# EAGLE design Hammercopy (EAGLE 6.3)
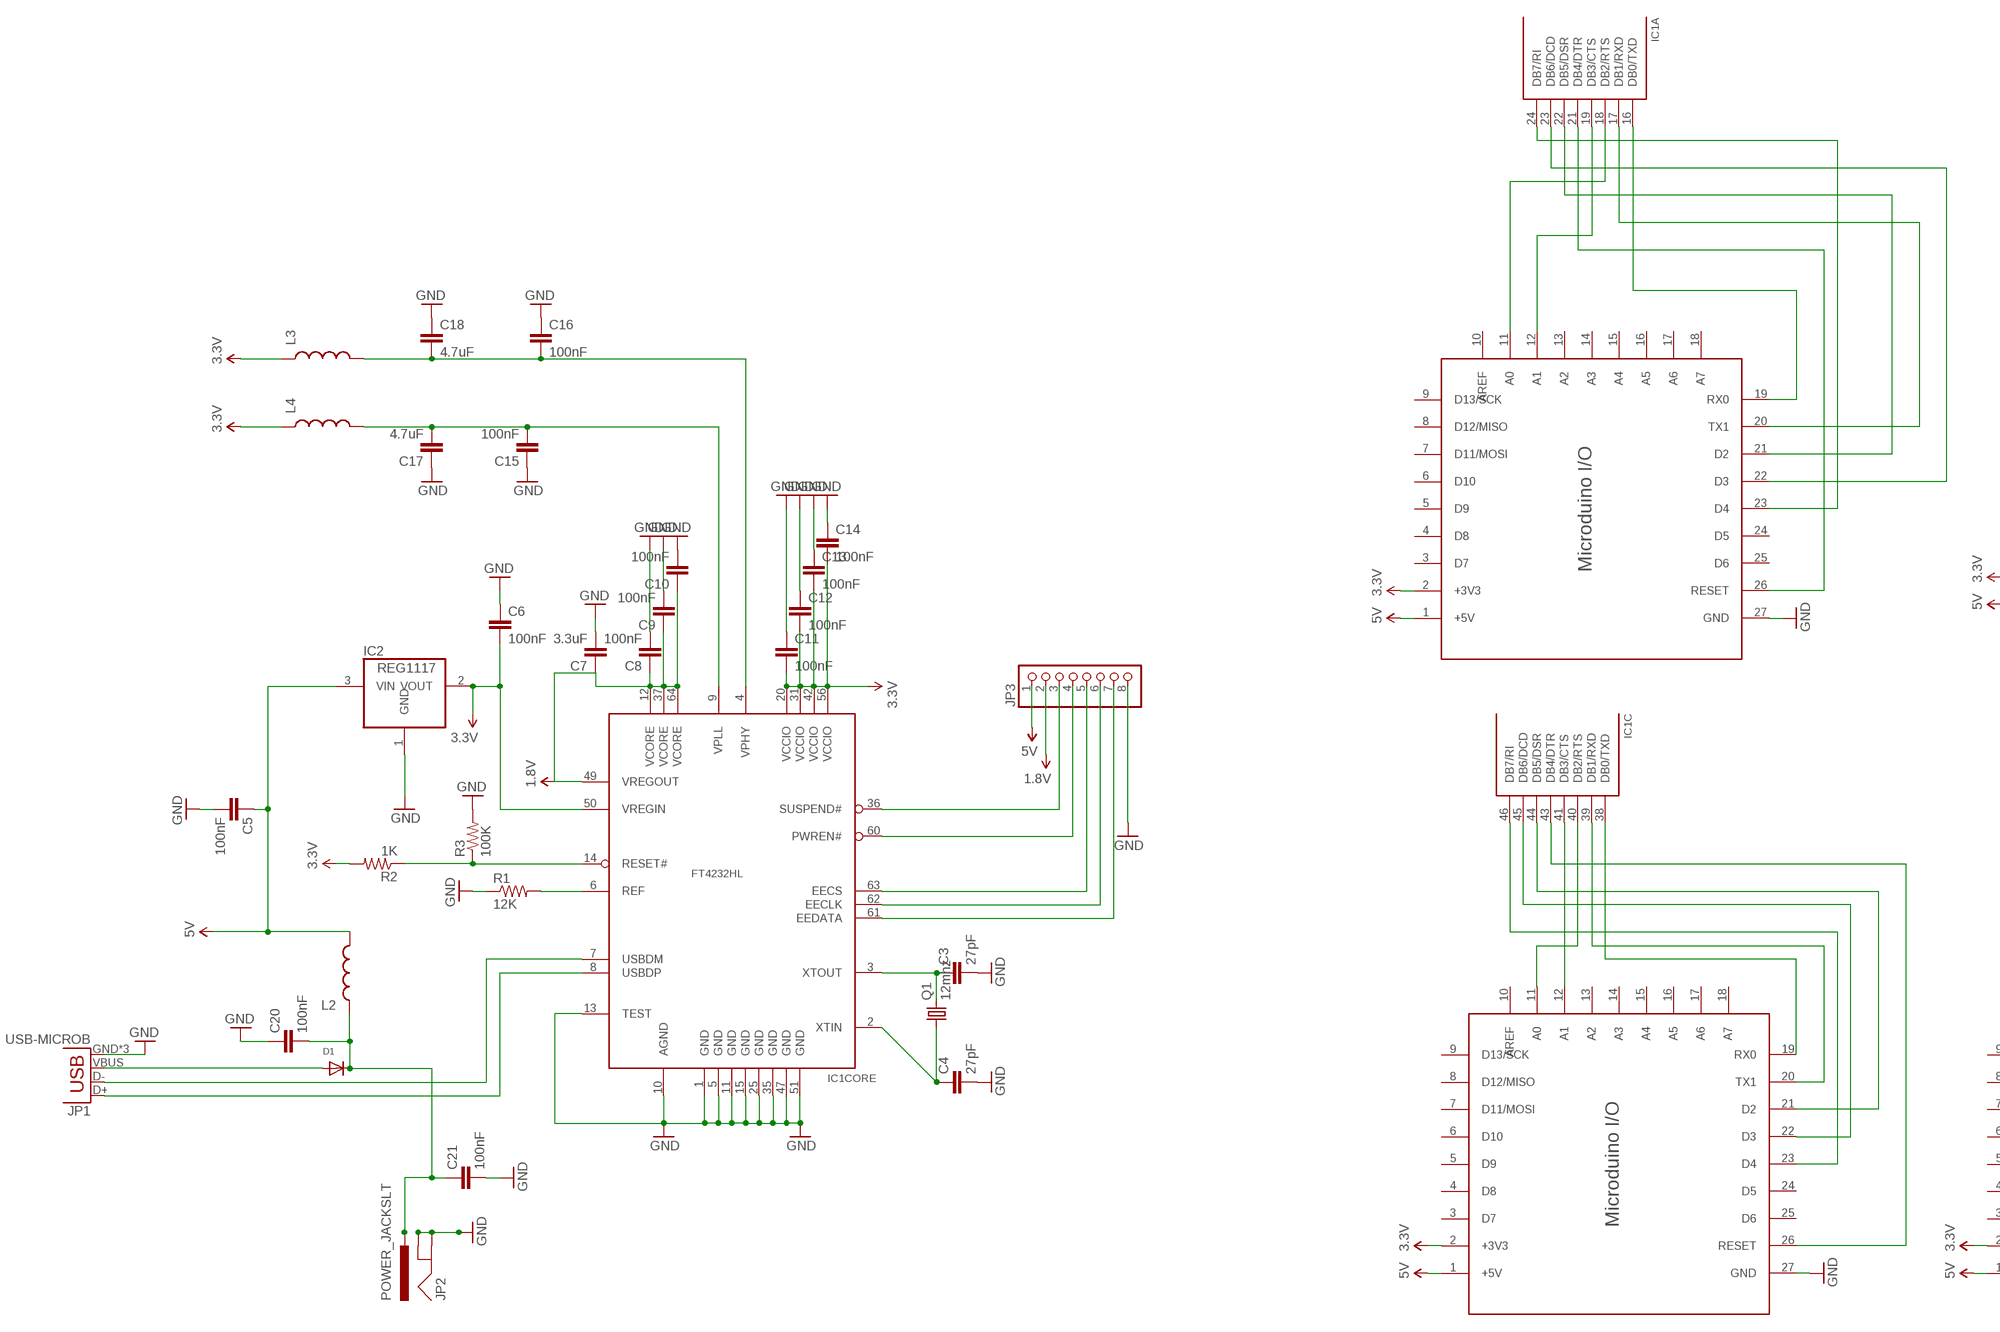
[diagram p0: schematic, sheet 1, part 1 of 2]
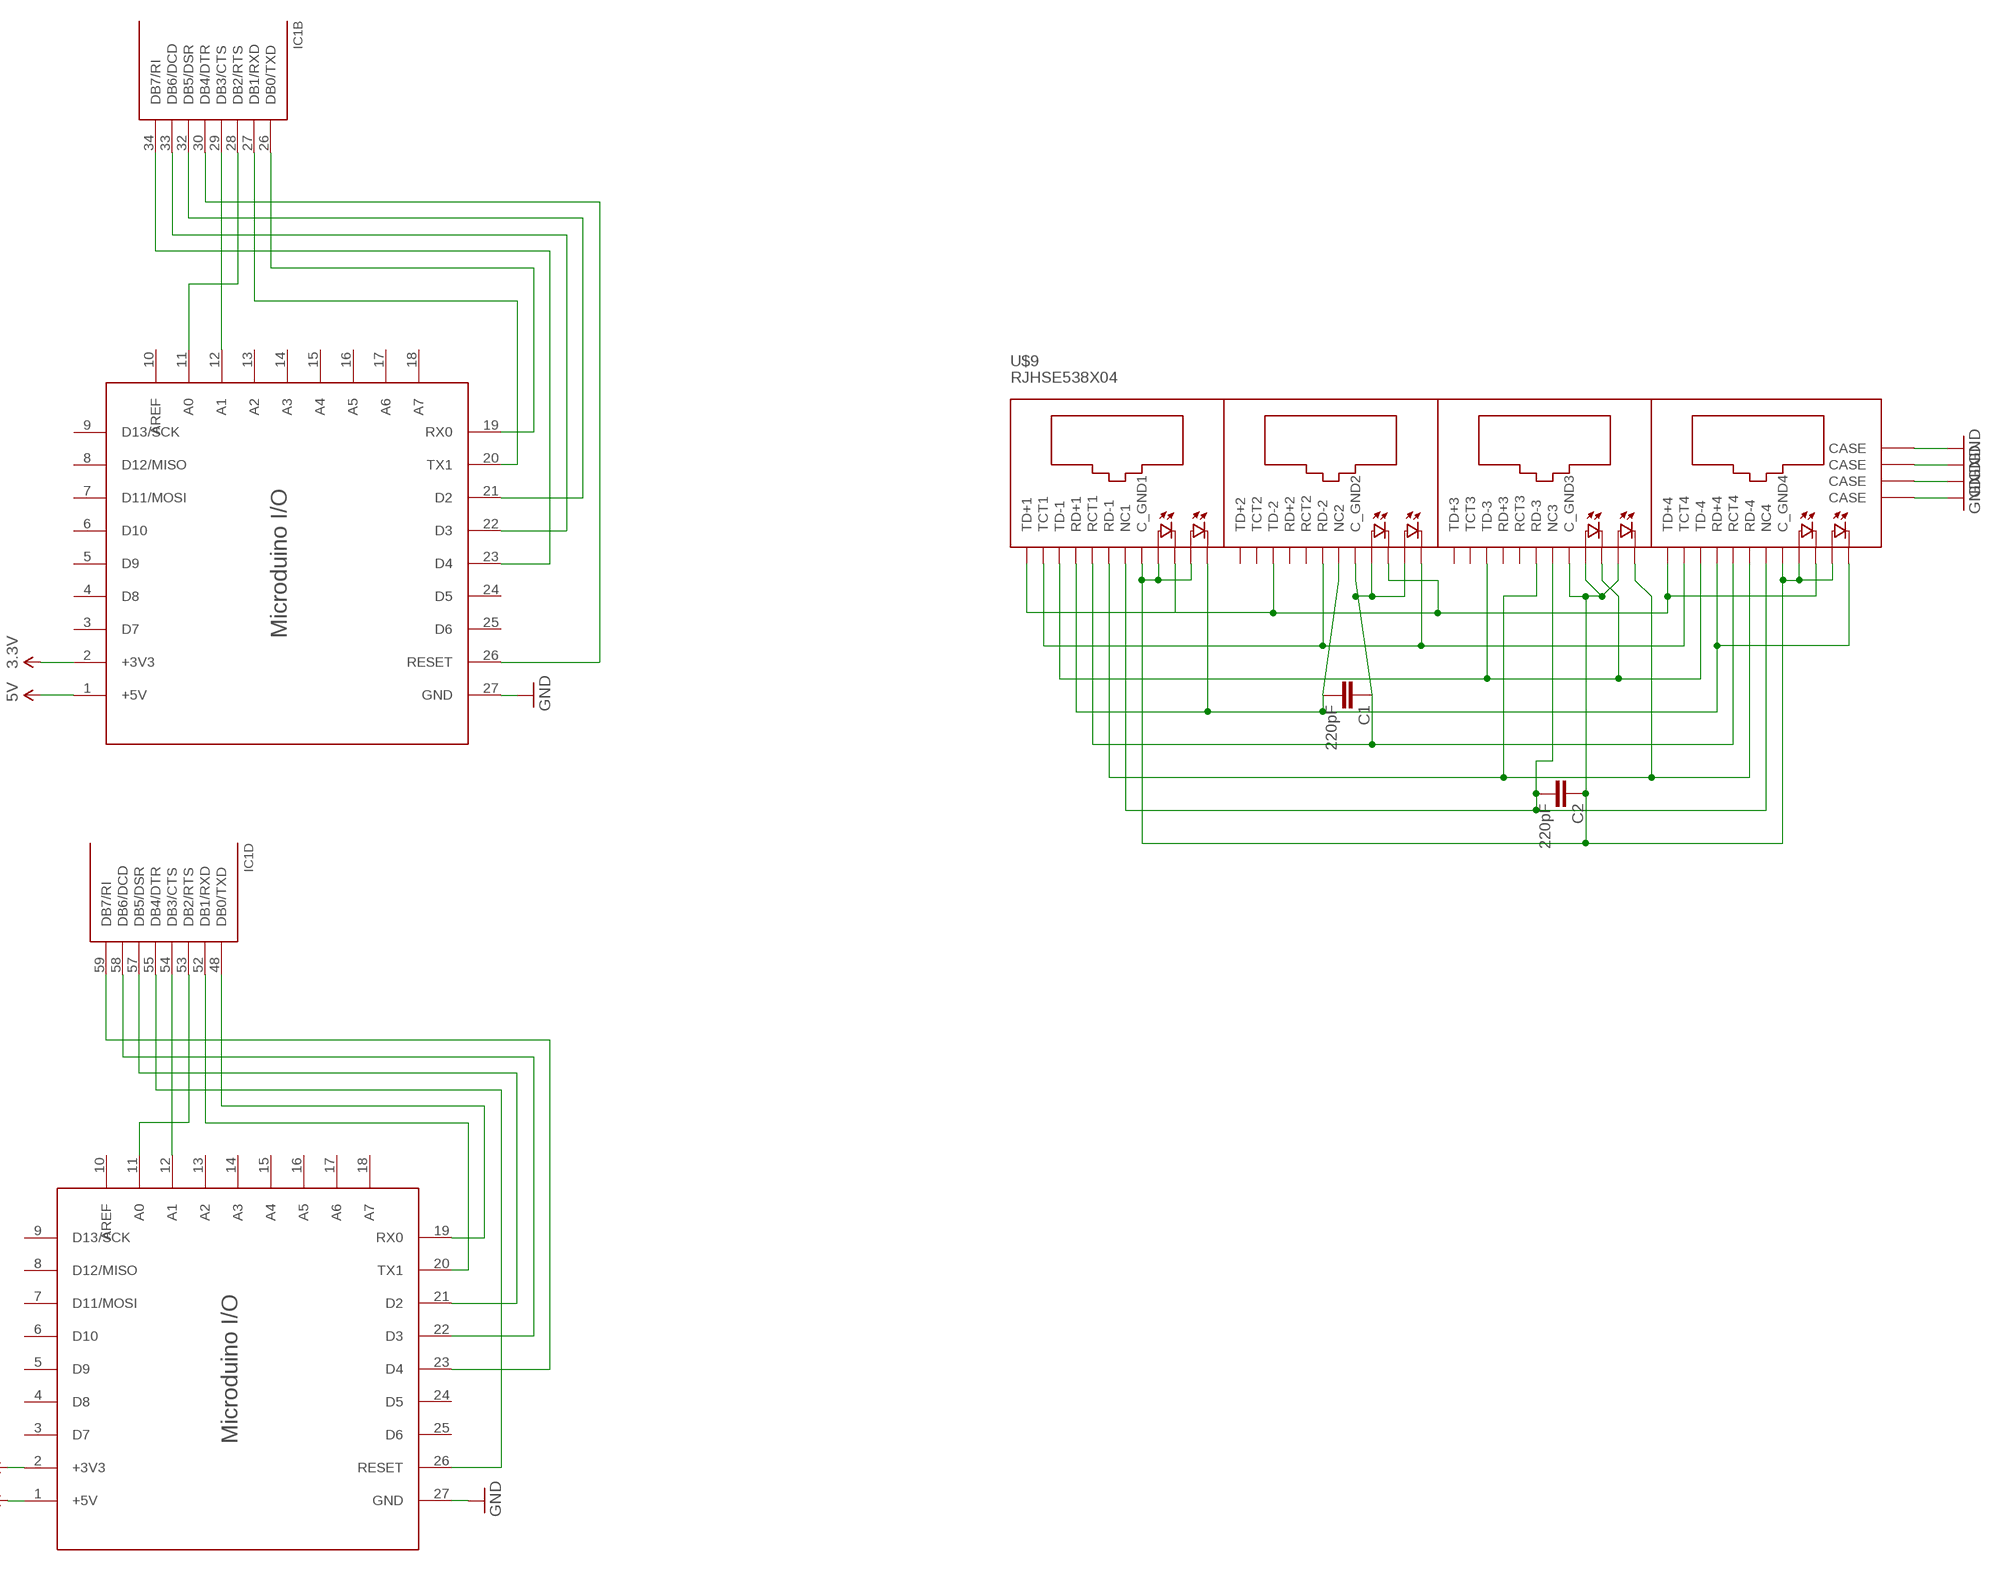
[diagram p1: schematic, sheet 1, part 2 of 2]

## Parts
C1  220pF  CAP0402-CAP  [0402-CAP]
C2  220pF  CAP0402-CAP  [0402-CAP]
C3  27pF  CAP0402-CAP  [0402-CAP]
C4  27pF  CAP0402-CAP  [0402-CAP]
C5  100nF  CAP0402-CAP  [0402-CAP]
C6  100nF  0.1UF-16V(+-10%)(0402)  [0402-CAP]
C7  3.3uF  0.1UF-16V(+-10%)(0402)  [0402-CAP]
C8  100nF  0.1UF-16V(+-10%)(0402)  [0402-CAP]
C9  100nF  0.1UF-16V(+-10%)(0402)  [0402-CAP]
C10  100nF  0.1UF-16V(+-10%)(0402)  [0402-CAP]
C11  100nF  0.1UF-16V(+-10%)(0402)  [0402-CAP]
C12  100nF  0.1UF-16V(+-10%)(0402)  [0402-CAP]
C13  100nF  0.1UF-16V(+-10%)(0402)  [0402-CAP]
C14  100nF  0.1UF-16V(+-10%)(0402)  [0402-CAP]
C15  100nF  0.1UF-16V(+-10%)(0402)  [0402-CAP]
C16  100nF  0.1UF-16V(+-10%)(0402)  [0402-CAP]
C17  4.7uF  0.1UF-16V(+-10%)(0402)  [0402-CAP]
C18  4.7uF  0.1UF-16V(+-10%)(0402)  [0402-CAP]
C20  100nF  0.1UF-16V(+-10%)(0402)  [0402-CAP]
C21  100nF  0.1UF-16V(+-10%)(0402)  [0402-CAP]
D1  DIODESMA  [SMADIODE]
IC1  FT4232HL  [LQFP64]
IC2  REG1117  [SOT223]
JP1  USB-MICROB  [USB-MICROB]
JP2  POWER_JACKSLT  [POWER_JACK_SLOT]
JP3  PINHD-1X8BIG  [1X08-BIG]
L2  INDUCTOR1206H*  [INDUCTOR-1206]
L3  INDUCTOR1206H*  [INDUCTOR-1206]
L4  INDUCTOR1206H*  [INDUCTOR-1206]
Q1  12mhz  CRYSTALHC49UP  [HC49UP]
R1  12K  RESISTOR0402-RES  [0402-RES]
R2  1K  RESISTOR0402-RES  [0402-RES]
R3  100K  RESISTOR0402-RES  [0402-RES]
U$5  MICRODUINO_PING-MICRDUINO/1009-TEST  [MICRODUINO_PIN-MICRODUINO-1009-TEST]
U$6  MICRODUINO_PING-MICRDUINO/1009-TEST  [MICRODUINO_PIN-MICRODUINO-1009-TEST]
U$7  MICRODUINO_PING-MICRDUINO/1009-TEST  [MICRODUINO_PIN-MICRODUINO-1009-TEST]
U$8  MICRODUINO_PING-MICRDUINO/1009-TEST  [MICRODUINO_PIN-MICRODUINO-1009-TEST]
U$9  RJHSE538X04  [RJHSE538X04]

## Nets
1.8V: C7.1 C8.1 C9.1 C10.1 IC1.12(CORE:VCORE) IC1.37(CORE:VCORE) IC1.49(CORE:VREGOUT) IC1.64(CORE:VCORE) JP3.2
3.3V: C6.2 C11.2 C12.2 C13.2 C14.2 IC1.20(CORE:VCCIO) IC1.31(CORE:VCCIO) IC1.42(CORE:VCCIO) IC1.56(CORE:VCCIO) IC2.2(VOUT) L3.P$1 L4.P$1 R2.2 U$5.2(+3V3) U$6.2(+3V3) U$7.2(+3V3) U$8.2(+3V3)
5V: C5.1 IC2.3(VIN) JP3.1 L2.P$2 U$5.1(+5V) U$6.1(+5V) U$7.1(+5V) U$8.1(+5V)
ASDF: C2.1 U$9.1-8(C_GND1) U$9.1-10(A2) U$9.1-12(A1) U$9.3-8(C_GND3) U$9.3-10(A6) U$9.3-12(A5)
GND: C3.2 C4.2 C5.2 C6.1 C7.2 C8.2 C9.2 C10.2 C11.1 C12.1 C13.1 C14.1 C15.1 C16.1 C17.1 C18.1 C20.1 C21.2 IC1.1(CORE:GND) IC1.5(CORE:GND) IC1.10(CORE:AGND) IC1.11(CORE:GND) IC1.13(CORE:TEST) IC1.15(CORE:GND) IC1.25(CORE:GND) IC1.35(CORE:GND) JP1.GND JP1.MT1(GND) JP1.MT2(GND) JP2.GND@1(GNDBREAK) JP2.GND@2(GND) JP3.8 R1.1 R3.2 U$5.27(GND) U$6.27(GND) U$7.27(GND) U$8.27(GND) U$9.CASE@1(CASE) U$9.CASE@2(CASE) U$9.CASE@3(CASE) U$9.CASE@4(CASE)
INJECT: U$9.1-1(TD+1) U$9.1-11(C1) U$9.2-3(TD-2) U$9.2-11(C3)
N$1: IC1.34(B:DB7/RI) U$7.23(D4)
N$2: IC1.30(B:DB4/DTR) U$7.26(RESET)
N$3: IC1.32(B:DB5/DSR) U$7.21(D2)
N$5: IC1.21(A:DB4/DTR) U$5.26(RESET)
N$6: IC1.16(A:DB0/TXD) U$5.19(RX0)
N$7: IC1.41(C:DB3/CTS) U$8.12(A1)
N$8: IC1.40(C:DB2/RTS) U$8.11(A0)
N$9: IC1.7(CORE:USBDM) JP1.D-
N$10: IC1.6(CORE:REF) R1.2
N$11: IC1.14(CORE:RESET#) R2.1 R3.1
N$12: IC1.39(C:DB1/RXD) U$8.20(TX1)
N$13: IC1.38(C:DB0/TXD) U$8.19(RX0)
N$14: IC1.46(C:DB7/RI) U$8.23(D4)
N$15: IC1.45(C:DB6/DCD) U$8.22(D3)
N$16: IC1.36(CORE:SUSPEND#) JP3.3
N$17: IC1.60(CORE:PWREN#) JP3.4
N$18: IC1.17(A:DB1/RXD) U$5.20(TX1)
N$19: IC1.63(CORE:EECS) JP3.5
N$20: IC1.62(CORE:EECLK) JP3.6
N$21: IC1.61(CORE:EEDATA) JP3.7
N$22: IC1.33(B:DB6/DCD) U$7.22(D3)
N$23: IC1.18(A:DB2/RTS) U$5.11(A0)
N$24: IC1.19(A:DB3/CTS) U$5.12(A1)
N$25: IC1.22(A:DB5/DSR) U$5.21(D2)
N$26: IC1.23(A:DB6/DCD) U$5.22(D3)
N$27: IC1.24(A:DB7/RI) U$5.23(D4)
N$28: IC1.44(C:DB5/DSR) U$8.21(D2)
N$29: IC1.29(B:DB3/CTS) U$7.12(A1)
N$30: IC1.28(B:DB2/RTS) U$7.11(A0)
N$31: IC1.26(B:DB0/TXD) U$7.19(RX0)
N$32: IC1.27(B:DB1/RXD) U$7.20(TX1)
N$33: IC1.43(C:DB4/DTR) U$8.26(RESET)
N$34: IC1.54(D:DB3/CTS) U$6.12(A1)
N$35: IC1.53(D:DB2/RTS) U$6.11(A0)
N$36: D1.A JP1.VBUS
N$37: U$9.1-2(TCT1) U$9.2-6(RD-2) U$9.2-9(C4)
N$38: U$9.1-3(TD-1) U$9.3-3(TD-3) U$9.3-11(C5)
N$39: C3.1 IC1.3(CORE:XTOUT) Q1.2
N$40: C4.1 IC1.2(CORE:XTIN) Q1.1
N$41: U$9.1-6(RD-1) U$9.3-6(RD-3) U$9.3-9(C6)
N$42: IC1.8(CORE:USBDP) JP1.D+
N$43: IC1.52(D:DB1/RXD) U$6.20(TX1)
N$44: C1.2 U$9.1-4(RD+1) U$9.1-9(C2) U$9.2-7(NC2)
N$45: C1.1 U$9.1-5(RCT1) U$9.2-8(C_GND2)
N$46: IC1.48(D:DB0/TXD) U$6.19(RX0)
N$47: C2.2 U$9.1-7(NC1) U$9.3-7(NC3)
N$48: IC1.55(D:DB4/DTR) U$6.26(RESET)
N$49: IC1.57(D:DB5/DSR) U$6.21(D2)
N$50: IC1.58(D:DB6/DCD) U$6.22(D3)
N$51: IC1.59(D:DB7/RI) U$6.23(D4)
N$55: U$9.4-1(TD+4) U$9.4-11(C7)
N$56: C15.2 C17.2 IC1.9(CORE:VPLL) L4.P$2
N$57: C20.2 C21.1 D1.C JP2.PWR L2.P$1
N$58: C16.2 C18.2 IC1.4(CORE:VPHY) L3.P$2
N$59: U$9.4-2(TCT4)
N$60: U$9.4-3(TD-4)
N$61: U$9.4-4(RD+4) U$9.4-9(C8)
N$62: U$9.4-5(RCT4)
N$63: U$9.4-6(RD-4)
N$64: U$9.4-7(NC4)
N$65: U$9.4-8(C_GND4) U$9.4-10(A8) U$9.4-12(A7)
N$69: U$9.2-10(A4) U$9.2-12(A3)
Unconnected: IC1.50(CORE:VREGIN) U$5.3(D7) U$5.4(D8) U$5.5(D9) U$5.6(D10) U$5.7(D11/MOSI) U$5.8(D12/MISO) U$5.9(D13/SCK) U$5.10(AREF) U$5.13(A2) U$5.14(A3) U$5.15(A4) U$5.16(A5) U$5.17(A6) U$5.18(A7) U$5.24(D5) U$5.25(D6) U$6.3(D7) U$6.4(D8) U$6.5(D9) U$6.6(D10) U$6.7(D11/MOSI) U$6.8(D12/MISO) U$6.9(D13/SCK) U$6.10(AREF) U$6.13(A2) U$6.14(A3) U$6.15(A4) U$6.16(A5) U$6.17(A6) U$6.18(A7) U$6.24(D5) U$6.25(D6) U$7.3(D7) U$7.4(D8) U$7.5(D9) U$7.6(D10) U$7.7(D11/MOSI) U$7.8(D12/MISO) U$7.9(D13/SCK) U$7.10(AREF) U$7.13(A2) U$7.14(A3) U$7.15(A4) U$7.16(A5) U$7.17(A6) U$7.18(A7) U$7.24(D5) U$7.25(D6) U$8.3(D7) U$8.4(D8) U$8.5(D9) U$8.6(D10) U$8.7(D11/MOSI) U$8.8(D12/MISO) U$8.9(D13/SCK) U$8.10(AREF) U$8.13(A2) U$8.14(A3) U$8.15(A4) U$8.16(A5) U$8.17(A6) U$8.18(A7) U$8.24(D5) U$8.25(D6) U$9.2-1(TD+2) U$9.2-2(TCT2) U$9.2-4(RD+2) U$9.2-5(RCT2) U$9.3-1(TD+3) U$9.3-2(TCT3) U$9.3-4(RD+3) U$9.3-5(RCT3)

## Power pins joined to a net without a drawn wire
GND: IC1.47(CORE:GND) IC1.51(CORE:GND) IC2.1(GND)

## Library data of the parts
C1-C5 = SparkFun-Passives:CAP: Capacitor Standard 0603 ceramic capacitor, and 0.1" leaded capacitor.
C6-C18 C20 C21 = SparkFun-Capacitors:0.1UF-16V(+-10%)(0402); PROD_ID: CAP-12416; VALUE: 0.1uF
D1 = adafruit:DIODE: Diode SMADIODE - SMA Surface Mount Package 20V 1A Schottky Diode Digikey: 641-1014-6-ND DO-1N4148 - Through Hole Small Current Diode SOD-123 20V 1 A (.5mV Vf) Schottky Diode - Digikey: MBRX120TPMSCT-ND SOD-323 10V 570mA (.38mV Vf, 3ns) Schottky Diode - Digikey: ZLLS410CT-ND SOD-523 30V 30mA Schottky Diode (RB751S-40TE61) - Digikey: RB751S-40TE61CT-ND SOT23-R/W - SOT23 Package (R = Solder Paste/Reflow Ovens, W = Hand-Soldering) BAT54Film 40V 300mA - Digikey: 497-7162-1-ND
IC1 = APA Parts:FT4232H: Quad USB UART 5th generation USB to 4-port serial controller
IC2 = burr-brown:REG1117: 800mA and 1A Low Dropout (LDO) Positive Regulator 1.8V, 2.5V, 2.85V, 3.3V, 5V, and Adj; MPN: REG1117; OC_FARNELL: 1097566; OC_NEWARK: 14P6981
JP1 = SparkFun-Connectors:USB: USB Connectors USB-B-PTH is fully proven SKU : PRT-00139/CONN-08278 USB-miniB is fully proven SKU : PRT-00587 USB-A-PCB is untested. USB-A-H is throughly reviewed, but untested. Spark Fun Electronics SKU : PRT-00437 USB-B-SMT is throughly reviewed, but untested. Needs silkscreen touching up. USB-A-S has not been used/tested USB-MB-H has not been used/tested USB-MICROB has been used. CONN-09505; PROD_ID: CONN-09505
JP2 = SparkFun-Connectors:POWER_JACK: Power Jack This is the standard 5.5mm barrel jack for power. The PTH is the most common, proven, reliable, footprint. The Slot footprint only works if the mill layer is transmitted to the PCB fab house so be warned. Mating wall wart : TOL-00298 (and others); PROD_ID: PRT-00119
JP3 = adafruit:PINHD-1X8: PIN HEADER
L2-L4 = SparkFun-Passives:INDUCTOR: Inductors Basic Inductor/Choke - 0603 and 1206. Footprints are not proven and vary greatly between part numbers. INDUCTOR POWER 3.3UH 4.0A SMD 0.197" L x 0.197" W x 0.177" H (5.00mm x 5.00mm x 4.50mm)
Q1 = crystal:CRYSTAL: CRYSTAL; OC_FARNELL: unknown; OC_NEWARK: unknown
R1-R3 = SparkFun-Passives:RESISTOR: Resistor Basic schematic elements and footprints for 0603, 1206, and PTH resistors.
U$5-U$8 = MicroArduinoCore:MICRODUINO_PING-MICRDUINO: microduino????
U$9 = RJHSE538x04:RJHSE538X04: Datasheets RJHSE538x04 Catalog Drawings RJ45 Series Right Angle PCN Design/Specification Multiple Series Copper 29/Jan/2009 RJHSE Shield Material 30/Jun/2015 Standard Package 40 Category Connectors, Interconnects Family Modular Connectors - Jacks Series RJHSE Packaging ? Tray ? Connector Type Jack Number of Positions/Contacts 8p8c (RJ45, Ethernet) Number of Ports 4 Number of Rows 1 Mounting Type Through Hole Orientation 90° Angle (Right) Termination Solder Shielding Shielded, EMI Finger Ratings - Features Board Lock LED Color Green - Yellow Ingress Protection - Tab Direction Up Contact Material Phosphor Bronze Contact Finish Gold Contact Finish Thickness 50µin (1.27µm) Housing Material Thermoplastic Operating Temperature -55°C ~ 85°C Online Catalog RJHSE Series Other Names RJHSE538404

## Net classes
0 default: width 0.254 mm, drill 0.254 mm, clearance 0.254 mm

## Board
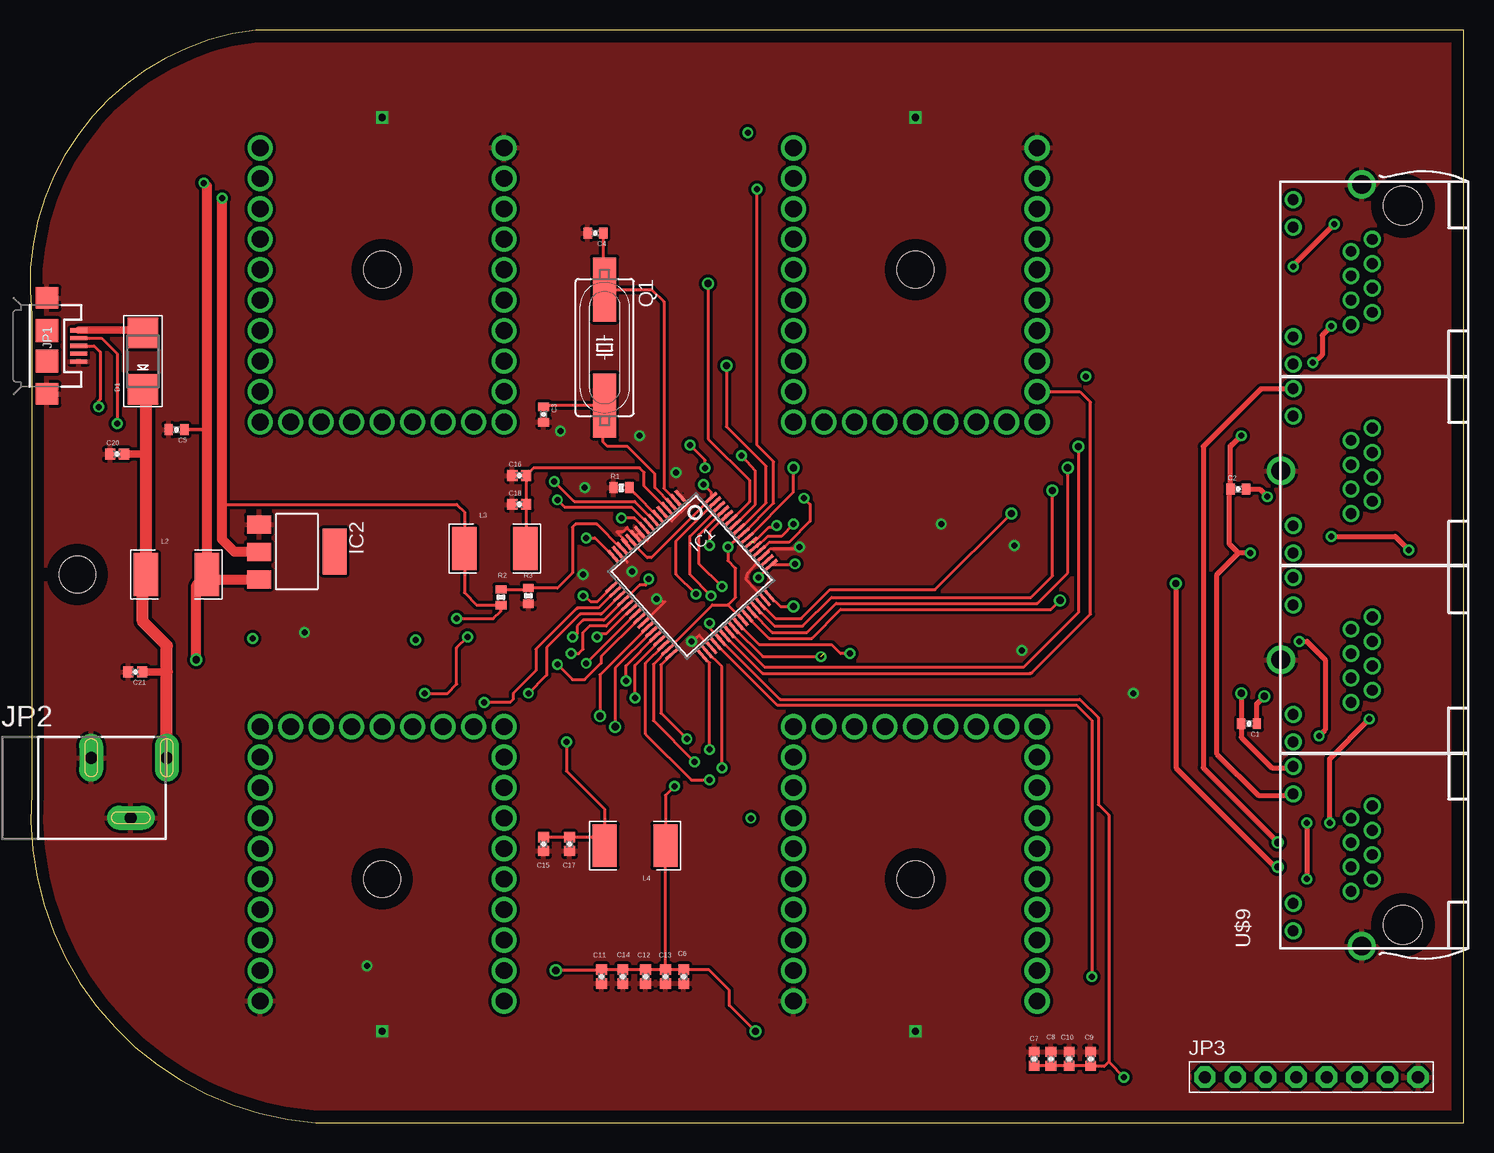
[diagram p2: board, top side]
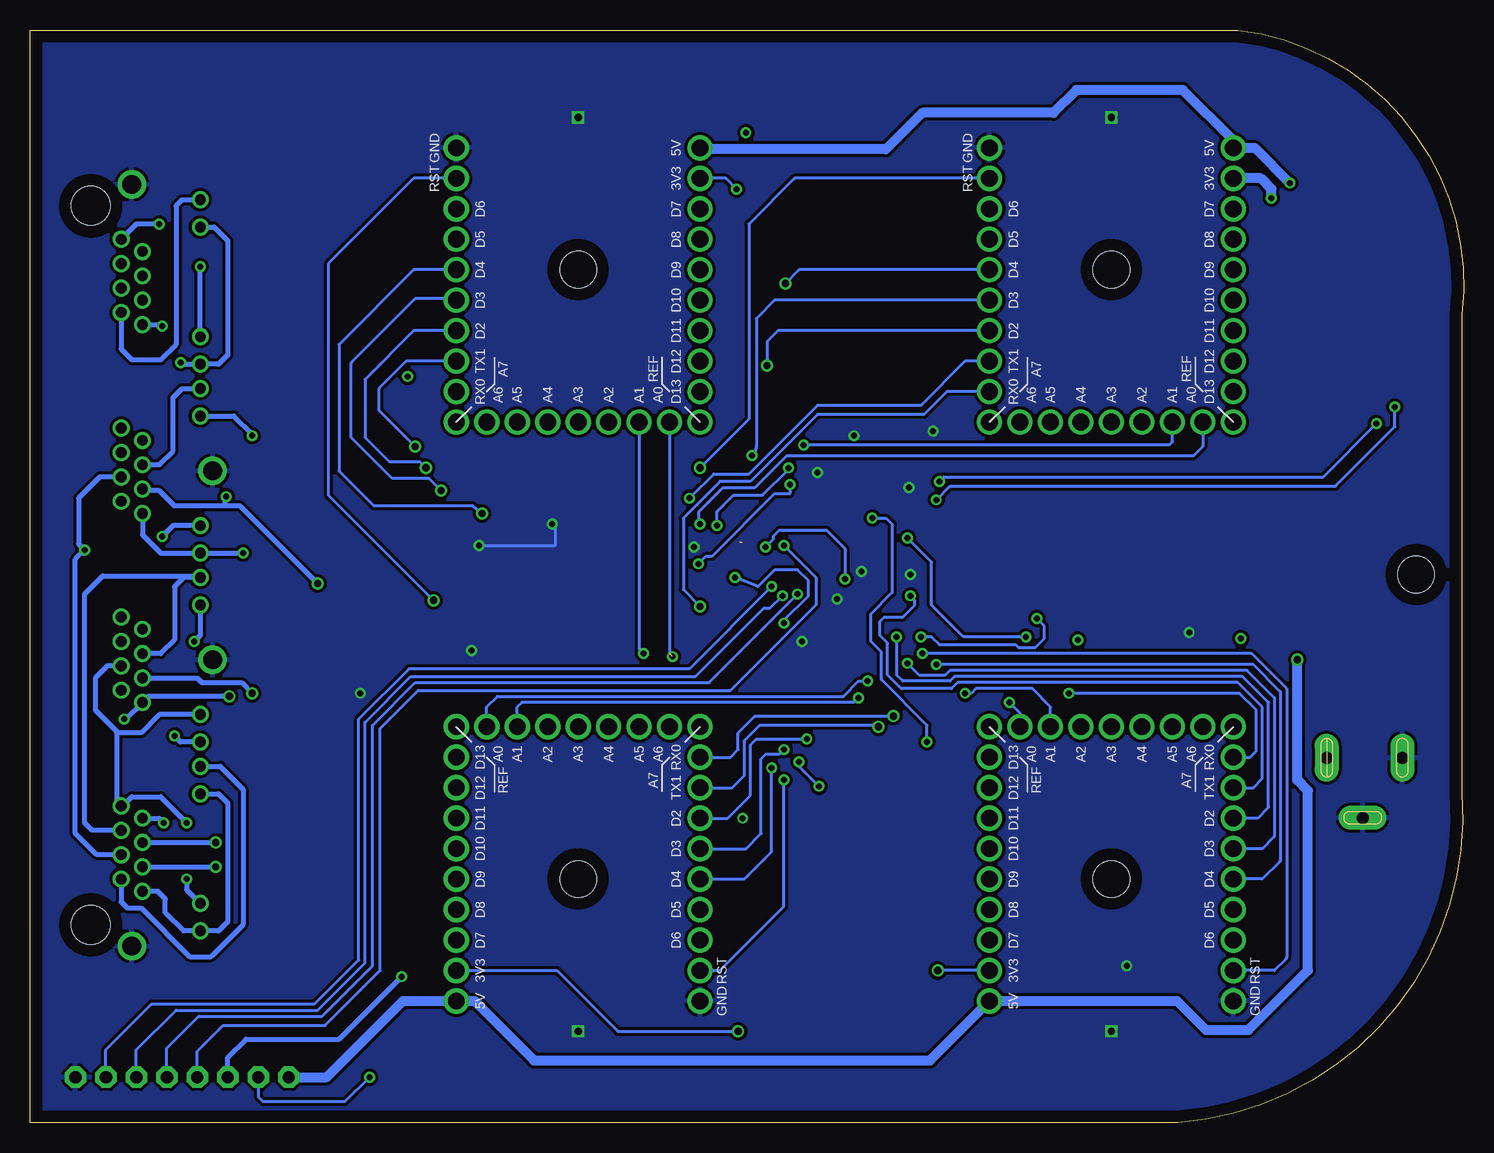
[diagram p3: board, bottom side, seen from below]

Size 119.5 x 91.11 mm. Coordinates in mm from the lower left corner, seen from the top.
Outline: 119.5,91.11 18.8,91.11 arc90 0.14,67.37 0.14,27.49 arc90 23.82,0 119.5,0 119.5,91.11
Copper layers (1*16): Top 0.035mm / dielectric 1.5mm / Bottom 0.035mm
Design rules "default": minimum track width 10mil, minimum drill 24mil, track to track 8mil, track to pad 8mil, pad to pad 8mil, via to via 8mil, smd to smd 8mil, copper to edge 40mil, drill to drill 8mil, minimum pad ring 10mil, minimum via ring 8mil, stop-mask expansion 4mil, vias tented up to drill 0mil, thermal gap 10mil

### Footprints (pad centres in the part's own frame; a part is rotated, then mirrored left to right if it is on the bottom)
0402-CAP = smd 0.7 x 0.9: 1 -0.65,0; 2 0.65,0
0402-CAP' = smd 0.85 x 0.9: 1 -0.58,0; 2 0.58,0
SMADIODE = smd 2.54 x 2.54: A 2.349,0; C -2.349,0
LQFP64 = smd 0.25 x 1.2: 1 -3.75,-5.6; 2 -3.25,-5.6; 3 -2.75,-5.6; 4 -2.25,-5.6; 5 -1.75,-5.6; 6 -1.25,-5.6; 7 -0.75,-5.6; 8 -0.25,-5.6; 9 0.25,-5.6; 10 0.75,-5.6; 11 1.25,-5.6; 12 1.75,-5.6; 13 2.25,-5.6; 14 2.75,-5.6; 15 3.25,-5.6; 16 3.75,-5.6; 33 3.75,5.6; 34 3.25,5.6; 35 2.75,5.6; 36 2.25,5.6; 37 1.75,5.6; 38 1.25,5.6; 39 0.75,5.6; 40 0.25,5.6; 41 -0.25,5.6; 42 -0.75,5.6; 43 -1.25,5.6; 44 -1.75,5.6; 45 -2.25,5.6; 46 -2.75,5.6; 47 -3.25,5.6; 48 -3.75,5.6 | smd 1.2 x 0.25: 17 5.6,-3.75; 18 5.6,-3.25; 19 5.6,-2.75; 20 5.6,-2.25; 21 5.6,-1.75; 22 5.6,-1.25; 23 5.6,-0.75; 24 5.6,-0.25; 25 5.6,0.25; 26 5.6,0.75; 27 5.6,1.25; 28 5.6,1.75; 29 5.6,2.25; 30 5.6,2.75; 31 5.6,3.25; 32 5.6,3.75; 49 -5.6,3.75; 50 -5.6,3.25; 51 -5.6,2.75; 52 -5.6,2.25; 53 -5.6,1.75; 54 -5.6,1.25; 55 -5.6,0.75; 56 -5.6,0.25; 57 -5.6,-0.25; 58 -5.6,-0.75; 59 -5.6,-1.25; 60 -5.6,-1.75; 61 -5.6,-2.25; 62 -5.6,-2.75; 63 -5.6,-3.25; 64 -5.6,-3.75
SOT223 = smd 1.499 x 2.007: 1 -2.261,-3.15; 2 0.025,-3.15; 3 2.311,-3.15 | smd 3.81 x 2.007: 4 0,3.15
USB-MICROB = smd 0.35 x 1.4: D+ 0,2.65; D- -0.65,2.65; GND 1.3,2.65; ID 0.65,2.65; VBUS -1.3,2.65 | smd 1.8 x 1.9: MT1 -4,0; MT2 4,0 | smd 1.9 x 1.9: P$1 -1.27,0; P$2 1.27,0
POWER_JACK_SLOT = drill 1 pad 2 long: GND@1 2.58,7.5; GND@2 7.58,10.8; PWR 2.58,13.8
1X08-BIG = drill 1.016 pad 1.778 octagon: 1 -8.89,0; 2 -6.35,0; 3 -3.81,0; 4 -1.27,0; 5 1.27,0; 6 3.81,0; 7 6.35,0; 8 8.89,0
INDUCTOR-1206 = smd 2.032 x 3.556: P$1 -2.54,0; P$2 2.54,0
HC49UP = smd 5.334 x 1.93: 1 -4.826,0; 2 4.826,0
0402-RES = smd 0.7 x 0.9: 1 -0.65,0; 2 0.65,0
STAND-OFF-TIGHT = hole 3.048: 0,0
MICRODUINO_PIN-MICRODUINO-1009-TEST = drill 1.4: 1 2.54,-10.16; 2 5.08,-10.16; 3 7.62,-10.16; 4 10.16,-10.16; 5 12.7,-10.16; 6 15.24,-10.16; 7 17.78,-10.16; 8 20.32,-10.16; 9 22.86,-10.16; 10 25.4,-10.16; 11 25.4,-7.62; 12 25.4,-5.08; 13 25.4,-2.54; 14 25.4,0; 15 25.4,2.54; 16 25.4,5.08; 17 25.4,7.62; 18 25.4,10.16; 19 22.86,10.16; 20 20.32,10.16; 21 17.78,10.16; 22 15.24,10.16; 23 12.7,10.16; 24 10.16,10.16; 25 7.62,10.16; 26 5.08,10.16; 27 2.54,10.16
RJHSE538X04 = drill 0.9: 1-1 9.906,2.54; 1-2 7.874,2.54; 1-3 5.842,2.54; 1-4 3.81,2.54; 1-5 8.89,4.318; 1-6 6.858,4.318; 1-7 4.826,4.318; 1-8 2.794,4.318; 1-9 13.208,9.144; 1-10 10.922,9.144; 1-11 1.778,9.144; 1-12 -0.508,9.144; 2-1 25.654,2.54; 2-2 23.622,2.54; 2-3 21.59,2.54; 2-4 19.558,2.54; 2-5 24.638,4.318; 2-6 22.606,4.318; 2-7 20.574,4.318; 2-8 18.542,4.318; 2-9 28.956,9.144; 2-10 26.67,9.144; 2-11 17.526,9.144; 2-12 15.24,9.144; 3-1 41.402,2.54; 3-2 39.37,2.54; 3-3 37.338,2.54; 3-4 35.306,2.54; 3-5 40.386,4.318; 3-6 38.354,4.318; 3-7 36.322,4.318; 3-8 34.29,4.318; 3-9 44.704,9.144; 3-10 42.418,9.144; 3-11 33.274,9.144; 3-12 30.988,9.144; 4-1 57.15,2.54; 4-2 55.118,2.54; 4-3 53.086,2.54; 4-4 51.054,2.54; 4-5 56.134,4.318; 4-6 54.102,4.318; 4-7 52.07,4.318; 4-8 50.038,4.318; 4-9 60.452,9.144; 4-10 58.166,9.144; 4-11 49.022,9.144; 4-12 46.736,9.144 | drill 1.575: CASE@1 -1.778,3.429; CASE@2 22.098,10.16; CASE@3 37.846,10.16; CASE@4 61.722,3.429 | hole 3.251: 0,0; 59.944,0

### Placement (x,y rotation side)
C1  101.62,33.27 180 top
C2  100.73,52.83 0 top
C3  42.82,59.05 270 top
C4  47.13,74.17 180 top
C5  12.21,57.79 180 top
C6  100nF  [0402-CAP']  54.5,12.19 90 top
C7  3.3uF  [0402-CAP']  83.71,5.33 90 top
C8  100nF  [0402-CAP']  85.11,5.33 90 top
C9  100nF  [0402-CAP']  88.41,5.33 90 top
C10  100nF  [0402-CAP']  86.63,5.33 90 top
C11  100nF  [0402-CAP']  47.64,12.19 90 top
C12  100nF  [0402-CAP']  51.32,12.19 90 top
C13  100nF  [0402-CAP']  52.98,12.19 90 top
C14  100nF  [0402-CAP']  49.42,12.19 90 top
C15  100nF  [0402-CAP']  42.82,23.24 90 top
C16  100nF  [0402-CAP']  40.78,53.98 0 top
C17  4.7uF  [0402-CAP']  44.97,23.24 90 top
C18  4.7uF  [0402-CAP']  40.78,51.56 0 top
C20  100nF  [0402-CAP']  7.26,55.75 0 top
C21  100nF  [0402-CAP']  8.78,37.59 180 top
D1  9.41,63.5 90 top
IC1  55.13,45.59 221.9 top
IC2  22.24,47.62 270 top
JP1  1.41,64.77 270 top
JP2  -2.4,33.02 270 top
JP3  106.82,3.81 0 top
L2  12.21,45.72 0 top
L3  38.75,47.88 0 top
L4  50.44,23.11 180 top
Q1  47.9,64.64 270 top
R1  49.29,52.96 0 top
R2  39.26,43.81 270 top
R3  41.55,43.94 270 top
U$1  [STAND-OFF-TIGHT]  29.35,20.32 0 top
U$2  [STAND-OFF-TIGHT]  73.8,20.32 0 top
U$3  [STAND-OFF-TIGHT]  73.8,71.12 0 top
U$4  [STAND-OFF-TIGHT]  29.35,71.12 0 top
U$5  29.35,7.62 90 top
U$6  29.35,83.82 270 top
U$7  73.8,7.62 90 top
U$8  73.8,83.82 270 top
U$9  114.44,16.51 90 top
U$10  [STAND-OFF-TIGHT]  3.95,45.72 0 top
U$11  [A4L-LOC]  -57.26,-51.31 0 top  (outside the outline)

### Tracks (layer width: path | path; a pad name or v marks a point on that pad's centre or on a via)
1.8V  (via drill 0.5)
  Top 0.254: IC1.12 50.09,48.48 51.45,47.12 51.79,47.12 IC1.64 56.8,52.56 v56.15,53.21 | 89.93,5.08 89.93,25.65 89.04,26.54 89.04,33.78 87.52,35.31 62.52,35.31 IC1.37 57.57,40.36 56.66,41.27 v56.66,41.66 | 89.93,5.08 89.55,4.7 88.46,4.7 C9.1 C10.1 C8.1 C7.1 | 89.93,5.08 v91.2,3.81 | v63.77,46.61 63.7,46.54 IC1.49 v60.72,45.47
  Bottom 0.254: JP3.2 100.47,2.16 100.09,1.78 93.23,1.78 v91.2,3.81 | v56.15,53.21 56.15,52.45 57.42,52.45 62.63,47.24 63.14,47.24 v63.77,46.61 | v60.72,45.47 58.82,44.7 57.42,46.1 55.52,46.1 54.63,45.21 54.63,43.94 56.66,41.91 v56.66,41.66
3.3V  (via drill 0.5, 0.6)
  Top 0.254: v60.6,77.85 60.6,56.52 61.99,55.12 61.99,51.67 IC1.56 v58.18,48.01 58.18,46.86 58.82,46.23 58.82,43.81 58.18,43.18 | v60.47,7.62 58.31,9.78 58.31,11.05 56.59,12.77 C6.2 C13.2 | 43.89,12.76 v43.83,12.7 47.57,12.7 C11.2 C14.2 C12.2 C13.2 | 58.18,43.18 56.88,43.18 IC1.31 53.14,39.4 51.96,38.23 51.96,33.53 v55.39,30.1 | 58.18,43.18 IC1.42 | C13.2 L4.P$1 52.98,27.3 v53.74,28.07 | v51.58,45.34 51.32,45.09 51.32,44.83 50.82,44.83 49.51,43.53 IC1.20 47.85,41.91 46.12,41.91 45.61,41.4 45.61,40.77 45.59,40.77 arc45 45.41,40.69 v45.23,40.51 | 16.02,51.56 35.58,51.56 36.21,50.93 L3.P$1 36.21,44.2 37.23,43.18 39.24,43.18 R2.2 39.26,42.67 38.62,42.04 v35.58,42.04
  Top 0.813: IC2.2 17.06,47.6 16.02,48.64 16.02,51.56 v16.02,77.09
  Bottom 0.254: U$7.2 75.58,12.7 70.5,7.62 v60.47,7.62 | U$5.2 v43.83,12.7 | v55.39,30.1 55.39,29.72 v53.74,28.07 | v51.58,45.34 51.58,47.88 53.1,49.4 57.04,49.4 57.55,48.9 57.55,48.64 v58.18,48.01 | v35.58,42.04 34.94,41.4 34.94,40.39 35.7,39.62 37.1,39.62 37.35,39.88 43.7,39.88 44.34,40.51 v45.23,40.51 | v60.6,77.85 61.48,78.74 U$8.2
  Bottom 0.813: v16.02,77.09 16.02,77.85 16.91,78.74 U$6.2
5V  (via drill 0.5, 0.6)
  Top 0.305: L2.P$2 14.62,45.72 14.62,57.79 C5.1
  Top 0.813: v13.86,38.61 13.86,44.83 L2.P$2 | v14.49,78.36 14.75,78.11 L2.P$2 | L2.P$2 14.75,45.31 IC2.3
  Bottom 0.813: U$8.1 63.01,81.28 62.88,81.15 48.15,81.15 45.1,84.2 34.18,84.2 32.27,86.11 23.38,86.11 19.19,81.92 U$6.1 17.42,81.28 v14.49,78.36 | JP3.1 94.76,3.81 88.41,10.16 U$7.1 82.44,10.16 77.49,5.21 44.47,5.21 U$5.1 23.89,10.16 21.48,7.75 17.92,7.75 12.97,12.7 12.97,27.69 13.86,28.57 v13.86,38.61
ASDF  (via drill 0.5)
  Top 0.406: U$9.1-10 105.17,27.3 102.38,27.3 98.95,30.73 98.95,45.72 100.73,47.5 | v100.98,57.28 100.2,56.5 100.08,56.5 C2.1 99.97,52.72 99.97,48.26 100.73,47.5 | v101.74,47.5 100.73,47.5
  Bottom 0.406: U$9.3-8 110.13,49.02 108.6,47.5 U$9.3-12 v101.74,47.5 | U$9.1-8 108.86,19.3 108.22,18.67 108.22,17.53 106.7,16 U$9.1-12 103.78,16 103.01,16.76 103.01,26.67 103.78,27.43 U$9.1-10 | U$9.3-10 102.51,58.93 100.98,57.4 v100.98,57.28
GND  (via drill 0.5, 0.6)
  Top 0.254: IC1.15 48.98,47.56 49.8,46.74 | IC1.47 59.71,45.31 59.83,45.85 IC1.51 61.73,47.88 64.02,47.88 v64.15,48.01 | IC1.1 54.88,51.57 54.88,51.56 53.48,50.16 52.72,50.93 IC1.5 | IC1.10 51.45,48.65 51.45,48.51 50.82,49.15 50.82,49.28 50.44,48.9 49.8,49.53 49.8,49.66 49.42,49.28 48.91,49.28 49.72,48.47 IC1.13 | IC1.35 55.78,40.64 v55.13,40.13 | v52.21,43.69 52.9,43.43 IC1.25
  Bottom 0.254: v82.06,48.13 75.71,48.13 75.71,49.91
  other vias: 22.88,40.89 73.8,7.62 46.12,45.72 29.35,83.82 73.8,83.82 91.96,35.81 82.69,39.37 75.96,49.91 50.18,45.97 53.86,54.23 44.21,57.66 50.82,57.28 46.24,52.96 29.35,7.62 28.08,13.08
  pour Top: 0.14,91.44 119.52,91.44 119.52,-0.25 0.52,0.08
  pour Bottom: 119.52,-0.25 0.4,0.16 0.14,91.44 119.52,91.82
INJECT  (via drill 0.5)
  Top 0.406: v106.44,25.02 v106.44,20.32
  Bottom 0.406: U$9.2-3 113.05,38.1 114.06,37.08 114.06,34.42 112.28,32.64 112.28,32.51 | 112.28,32.51 112.28,26.8 U$9.1-1 111.78,26.42 111.01,27.18 108.6,27.18 v106.44,25.02 | U$9.2-11 108.73,34.04 110.25,32.51 112.28,32.51 | v106.44,20.32 106.44,19.43 U$9.1-11
N$1  (via drill 0.5)
  Top 0.254: v57.67,29.59 57.67,38.03 IC1.34
  Bottom 0.254: U$7.23 59.96,20.32 57.67,22.61 v57.67,29.59
N$2  (via drill 0.5)
  Top 0.254: IC1.30 51.32,38.33 51.32,32.39 55.13,28.57 v56.66,28.57
  Bottom 0.254: U$7.26 61.99,12.7 56.66,18.03 v56.66,28.57
N$3  (via drill 0.5)
  Top 0.254: IC1.32 52.59,38.19 52.59,34.16 v54.75,32
  Bottom 0.254: U$7.21 61.36,25.4 59.45,27.3 59.45,31.5 58.94,32 v54.75,32
N$5  (via drill 0.5)
  Top 0.254: IC1.21 49.78,43.16 48.02,41.4 46.63,41.4 46.12,40.89 46.12,39.5 45.74,39.12 v45.1,39.12
  Bottom 0.254: v45.1,39.12 17.67,39.12 14.75,36.2 14.75,13.82 arc45 14.82,13.64 15.76,12.7 U$5.26
N$6  (via drill 0.5)
  Top 0.254: v46.37,48.77 47.09,48.77 IC1.16 | v36.47,40.51 35.58,39.62 35.58,36.58 34.81,35.81 v32.91,35.81
  Bottom 0.254: U$5.19 17.8,30.48 17.29,30.99 17.29,34.42 18.69,35.81 v32.91,35.81 | v46.37,48.77 44.34,46.74 44.34,43.18 41.67,40.51 v36.47,40.51
N$7  (via drill 0.5)
  Top 0.254: v68.34,39.12 67.58,39.12 66.82,39.88 60.77,39.88 IC1.41
  Bottom 0.254: U$8.12 68.72,39.5 v68.34,39.12
N$8  (via drill 0.5)  (1 unrouted)
  Top 0.254: IC1.40 61.08,38.86 v65.93,38.86
  Bottom 0.254: U$8.11 66.18,39.12
N$9  (via drill 0.5)
  Top 0.254: JP1.D- 5.97,65.42 7.26,64.13 v7.26,58.29 | IC1.7 50.4,51.82 45.36,51.82 v43.7,53.47
  Bottom 0.254: v43.7,53.47 43.32,53.85 11.7,53.85 v7.26,58.29
N$10
  Top 0.254: IC1.6 52.29,50.6 50.44,52.45 50.44,52.47 R1.2
N$11
  Top 0.254: R2.1 41.42,44.47 R3.1 41.56,44.58 43.96,44.58 45.23,45.85 45.23,49.66 45.48,49.91 47.26,49.91 49.25,47.92 IC1.14
N$12  (via drill 0.6)
  Top 0.254: v87.39,56.39 87.39,42.55 82.82,37.97 61.27,37.97 IC1.39
  Bottom 0.254: U$8.20 88.15,63.5 90.44,61.21 90.44,59.44 v87.39,56.39
N$13
  Top 0.254: U$8.19 87.52,60.96 88.41,60.07 88.41,42.42 83.53,37.54 arc-45 83.35,37.47 61.07,37.47 IC1.38
N$14  (via drill 0.6)
  Top 0.254: IC1.46 62.15,42.04 64.28,42.04 66.69,44.45 75.45,44.45 v81.8,50.8
  Bottom 0.254: U$8.23 87.52,71.12 93.74,64.9 93.74,54.36 90.82,51.44 82.57,51.44 v81.8,50.8
N$15  (via drill 0.6)
  Top 0.254: IC1.45 62.07,41.4 64.41,41.4 66.82,43.81 83.46,43.81 85.23,45.59 v85.23,52.7
  Bottom 0.254: v85.23,52.7 86.25,53.72 89.3,53.72 92.73,57.15 92.73,63.37 87.39,68.71 84.09,68.71 U$8.22
N$16  (via drill 0.5)
  Top 0.254: IC1.36 62.32,34.8 87.27,34.8 88.54,33.53 v88.54,12.19
  Bottom 0.406: JP3.3 103.01,5.46 101.49,6.99 93.74,6.99 v88.54,12.19
N$17  (via drill 0.5)
  Top 0.254: IC1.60 58.02,50.63 56.66,49.28 v56.66,48.13
  Bottom 0.254: JP3.4 105.55,5.97 103.39,8.13 94.89,8.13 90.31,12.7 90.31,32.89 87.14,36.07 61.1,36.07 53.99,43.18 53.99,45.47 v56.66,48.13
N$18  (via drill 0.5)
  Top 0.254: IC1.17 47.26,43.43 46.75,43.43 46.24,43.94 v46.12,43.94
  Bottom 0.254: U$5.20 17.54,27.94 16.78,28.7 16.78,34.67 18.81,36.7 42.18,36.7 42.69,36.2 46.88,36.2 48.02,37.34 48.02,40 48.66,40.64 48.66,41.78 48.28,42.16 46.75,42.16 45.74,43.18 45.74,43.56 v46.12,43.94
N$19  (via drill 0.5)
  Top 0.254: v55.52,44.07 53.86,45.72 53.86,48.51 57.1,51.75 IC1.63
  Bottom 0.254: JP3.5 108.09,6.22 105.43,8.89 95.14,8.89 90.95,13.08 90.95,33.15 87.39,36.7 62.88,36.7 v55.52,44.07
N$20  (via drill 0.5)
  Top 0.254: v56.79,43.94 55.01,45.72 55.01,48.9 57.47,51.35 IC1.62
  Bottom 0.254: JP3.6 110.63,6.1 107.33,9.4 95.52,9.4 91.58,13.34 91.58,33.4 87.77,37.21 64.02,37.21 58.31,42.93 57.8,42.93 v56.79,43.94
N$21  (via drill 0.5)
  Top 0.254: v57.67,44.7 55.77,46.61 55.77,49.02 57.76,51.01 IC1.61
  Bottom 0.254: JP3.7 113.17,6.1 109.36,9.91 95.77,9.91 92.09,13.59 92.09,33.66 87.9,37.85 64.53,37.85 v57.67,44.7
N$22  (via drill 0.5)
  Top 0.254: IC1.33 56.66,38.34 v56.66,31.12
  Bottom 0.254: U$7.22 59.83,22.86 58.56,24.13 58.56,30.35 58.18,30.73 57.04,30.73 v56.66,31.12
N$23  (via drill 0.5)
  Top 0.254: IC1.18 48.73,44.27 47.39,42.93 45.71,42.93 arc45 45.54,42.85 42.18,39.5 42.18,37.72 40.28,35.81 40.28,35.31 40.02,35.05 v37.86,35.05
  Bottom 0.254: U$5.11 36.97,34.16 v37.86,35.05
N$24  (via drill 0.5)
  Top 0.254: IC1.19 47.72,42.49 arc-45 47.54,42.42 45.86,42.42 43.07,39.62 43.07,37.34 v41.55,35.81
  Bottom 0.254: U$5.12 34.43,34.67 35.96,36.2 40.66,36.2 41.04,35.81 v41.55,35.81 41.42,35.69
N$25  (via drill 0.5)
  Top 0.254: IC1.22 49.77,42.42 49.67,42.42 48.02,40.77 47.51,40.77 v47.26,40.51
  Bottom 0.254: v47.26,40.51 47.26,37.34 46.75,36.83 42.82,36.83 42.43,37.21 18.43,37.21 16.27,35.05 16.27,26.39 arc45 16.35,26.21 17.16,25.4 U$5.21
N$26  (via drill 0.5)
  Top 0.254: v46.37,38.32 IC1.23
  Bottom 0.254: U$5.22 16.78,22.86 15.84,23.8 arc-45 15.76,23.98 15.76,35.43 18.05,37.72 42.82,37.72 43.2,37.34 45.39,37.34 v46.37,38.32
N$27  (via drill 0.5)
  Top 0.254: IC1.24 47.62,38.86 47.62,38.34 46.24,36.96 45.23,36.96 v43.96,38.23
  Bottom 0.254: v43.96,38.23 17.54,38.23 15.26,35.94 15.26,21.95 arc45 15.33,21.77 16.78,20.32 U$5.23
N$28  (via drill 0.6)
  Top 0.254: v86.5,54.61 86.5,45.85 83.96,43.31 67.2,43.31 64.79,40.89 61.87,40.89 IC1.44
  Bottom 0.254: U$8.21 87.52,66.04 91.58,61.98 91.58,57.15 89.55,55.12 87.01,55.12 v86.5,54.61
N$29  (via drill 0.5)
  Top 0.254: v50.44,35.43 50.44,38.14 IC1.29
  Bottom 0.254: U$7.12 78.88,34.67 78.5,35.05 50.82,35.05 v50.44,35.43
N$30  (via drill 0.5)
  Top 0.254: IC1.28 49.67,38.1 v49.67,36.83
  Bottom 0.254: U$7.11 81.42,34.67 80.53,35.56 51.71,35.56 50.44,36.83 v49.67,36.83
N$31  (via drill 0.6)
  Top 0.254: IC1.26 47.51,37.34 v47.51,33.91
  Bottom 0.254: U$7.19 61.1,30.48 60.47,31.12 60.47,32.51 59.07,33.91 v47.51,33.91
N$32  (via drill 0.6)
  Top 0.254: IC1.27 48.78,37.91 v48.78,33.02
  Bottom 0.254: U$7.20 60.98,27.94 59.96,28.96 59.96,31.88 58.69,33.15 48.91,33.15 v48.78,33.02
N$33  (via drill 0.6)
  Top 0.254: IC1.43 59.8,42.19 61.61,40.39 65.17,40.39 67.58,42.8 85.11,42.8 v85.87,43.56
  Bottom 0.254: U$8.26 87.52,78.74 94.63,71.63 94.63,52.32 v85.87,43.56
N$34  (via drill 0.5)  (1 unrouted)
  Top 0.254: 60.36,48.4 61.61,49.66 62.01,49.66 arc45 62.19,49.73 v62.25,49.78 | v56.28,54.61 56.28,55.24 v55.01,56.52
  Bottom 0.254: U$6.12 24.27,56.77 24.53,56.52 v55.01,56.52 | v56.28,54.61 56.28,54.48 58.44,52.32 60.85,52.32 62.17,51 arc-45 62.25,50.82 v62.25,49.78
N$35  (via drill 0.5)
  Top 0.254: v63.64,49.91 62.63,48.9 61.48,48.9 60.62,48.03 IC1.53
  Bottom 0.254: U$6.11 21.73,56.39 22.5,55.63 56.4,55.63 59.07,52.96 61.74,52.96 63.77,50.93 63.77,50.04 v63.64,49.91
N$36
  Top 0.61: JP1.VBUS 9.19,66.07 D1.A
N$37
  Bottom 0.406: U$9.2-6 108.6,39.12 107.46,40.26 107.46,44.7 106.7,45.47 U$9.2-9 105.43,45.59 113.43,45.59 114.95,44.07 114.95,25.02 114.32,24.38 U$9.1-2
N$38  (via drill 0.5)
  Top 0.406: v108.47,48.9 113.81,48.9 v114.95,47.75
  Bottom 0.406: U$9.3-11 107.59,49.78 v108.47,48.9 | U$9.1-3 113.94,22.35 115.71,24.13 115.71,46.99 v114.95,47.75 115.46,48.26 115.46,52.07 113.68,53.85 U$9.3-3
N$39
  Top 0.254: C3.1 42.93,59.82 Q1.2 47.77,59.69 47.77,56.77 48.15,56.39 49.8,56.39 52.09,54.1 52.09,52.96 IC1.3
N$40
  Top 0.254: C4.1 47.78,69.58 Q1.1 51.83,69.47 52.85,68.45 52.85,52.9 IC1.2
N$41  (via drill 0.6)
  Top 0.406: 103.9,23.37 v104.03,23.37 97.81,29.59 97.81,56.39 102.63,61.21 U$9.3-9
  Bottom 0.406: U$9.1-6 v104.03,23.37 | U$9.3-6 108.73,54.86 107.59,56.01 107.59,60.45 106.82,61.21 U$9.3-9
N$42  (via drill 0.5)
  Top 0.254: JP1.D+ 5.35,64.77 5.86,64.26 5.86,60.33 5.73,60.2 v5.73,59.69 | IC1.8 51.56,49.93 50.18,51.31 44.59,51.31 v43.96,51.94
  Bottom 0.254: v5.73,59.69 5.73,58.04 10.68,53.09 42.82,53.09 v43.96,51.94
N$43  (via drill 0.5)
  Top 0.254: IC1.52 60.88,47.66 61.61,48.39 63.26,48.39 65.04,50.16 65.04,51.56 v64.53,52.07
  Bottom 0.254: U$6.20 41.55,63.5 45.23,59.82 53.86,59.82 59.58,54.1 62.5,54.1 v64.53,52.07
N$44  (via drill 0.6)
  Top 0.406: v100.98,35.81 100.98,33.29 C1.2 100.97,32.15 103.52,29.59 105.17,29.59 U$9.1-9
  Bottom 0.406: U$9.1-4 111.9,18.41 111.4,17.91 110.25,17.91 106.19,13.84 104.41,13.84 101.74,16.51 101.74,27.81 103.65,29.72 U$9.1-9 | U$9.2-7 105.55,37.08 105.17,36.7 101.87,36.7 v100.98,35.81
N$45  (via drill 0.5, 0.6)
  Top 0.406: C1.1 102.27,34.94 v102.89,35.56 | v108.35,25.02 108.35,30.35 v111.65,33.66
  Bottom 0.406: v102.89,35.56 109.62,35.56 U$9.2-8 111.52,33.66 v111.65,33.66 | U$9.1-5 108.73,25.4 v108.35,25.02
N$46  (via drill 0.6)
  Top 0.254: IC1.48 62.54,43.05 v63.64,43.05
  Bottom 0.254: v63.64,43.05 65.04,44.45 65.04,50.42 61.99,53.47 59.45,53.47 53.86,59.05 44.97,59.05 43.07,60.96 U$6.19
N$47  (via drill 0.5, 0.6)
  Top 0.406: C2.2 102.51,52.83 v103.14,52.2 | 110,52.7 U$9.3-7 | v95.52,44.96 95.52,29.59 103.78,21.34 v104.03,21.34
  Bottom 0.406: U$9.1-7 v104.03,21.34 | U$9.3-7 110,52.7 108.73,52.7 107.46,51.44 103.27,51.44 | 103.27,51.44 102,51.44 v95.52,44.96 | v103.14,52.2 103.27,52.07 103.27,51.44
N$48  (via drill 0.6)
  Top 0.254: IC1.55 59.84,48.77 63.64,52.58 v63.64,54.61
  Bottom 0.254: v63.64,54.61 59.58,58.67 59.58,74.93 55.77,78.74 U$6.26
N$49  (via drill 0.6)
  Top 0.254: IC1.57 59.19,49.52 61.36,51.69 61.36,54.74 58.06,58.04 v58.06,63.12
  Bottom 0.254: U$6.21 57.17,66.04 58.06,65.15 v58.06,63.12
N$50  (via drill 0.5)
  Top 0.254: IC1.58 60.47,51.56 60.47,54.36 v59.33,55.63
  Bottom 0.254: U$6.22 57.42,68.58 58.94,67.06 58.94,56.52 arc46 v59.33,55.63
N$51  (via drill 0.6)
  Top 0.254: IC1.59 59.96,51.76 59.96,53.59 56.53,57.02 v56.53,69.98
  Bottom 0.254: U$6.23 55.39,71.12 v56.53,69.98
N$55  (via drill 0.5)
  Top 0.406: v105.3,71.37 105.3,71.5 v108.73,74.93
  Bottom 0.406: U$9.4-11 v105.3,71.37 | v108.73,74.93 110.63,74.93 U$9.4-1
N$56  (via drill 0.5)
  Top 0.254: IC1.9 50.38,50.42 v49.29,50.42 | v44.72,31.75 44.72,29.34 47.9,26.16 L4.P$2 47.19,23.82 C17.2 C15.2
  Bottom 0.254: v44.72,31.75 44.72,33.15 48.53,36.96 48.53,39.24 49.42,40.13 49.42,42.42 47.64,44.2 47.64,49.91 48.15,50.42 v49.29,50.42
N$57
  Top 0.61: C20.2 9.67,55.75 | C21.1 11.4,37.59
  Top 1.016: JP2.PWR 11.4,37.59 11.4,39.79 9.41,41.78 9.41,45.47 L2.P$1 9.67,55.75 9.67,60.9 D1.C
N$58
  Top 0.254: IC1.4 53.02,51.26 51.2,53.09 51.2,54.23 50.82,54.61 42,54.61 C16.2 C18.2 41.36,47.81 | 41.04,47.12 41.36,47.44 41.36,47.81 | 41.36,47.81 L3.P$2
N$61
  Bottom 0.406: U$9.4-4 111.9,64.52 111.01,63.63 108.6,63.63 107.33,64.9 107.33,76.45 106.82,76.96 U$9.4-9
N$65  (via drill 0.5)
  Top 0.406: v108.47,66.42 107.71,65.66 107.71,64.01 107.08,63.37 v106.95,63.37
  Bottom 0.406: U$9.4-10 104.16,74.68 103.01,73.53 103.01,64.01 103.78,63.25 U$9.4-12 106.82,63.25 v106.95,63.37 | U$9.4-8 108.6,66.55 v108.47,66.42
N$68  (via drill 0.5)
  other vias: 32.15,40.26
N$69  (via drill 0.5)
  Top 0.406: v107.46,32.26 107.97,32.77 107.97,38.61 106.44,40.13 v105.81,40.13
  Bottom 0.406: U$9.2-12 106.95,31.75 v107.46,32.26 | U$9.2-10 105.3,40.64 v105.81,40.13
N$70  (via drill 0.5)
  other vias: 60.09,25.4
N$75  (via drill 0.5)
  other vias: 88.03,62.23
N$86  (via drill 0.5)
  other vias: 59.83,82.55
N$93  (via drill 0.5)
  other vias: 18.56,40.39

### Text on the board
tTest: HoneyBadges.com